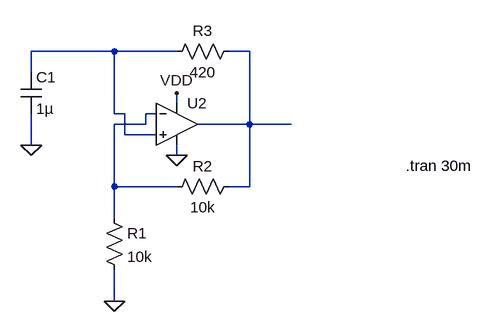
[diagram p0: schematic Draft1.asc]
Draft1.asc, the LTspice schematic file:
Version 4
SHEET 1 880 680
WIRE -272 -192 -400 -192
WIRE -176 -192 -272 -192
WIRE -64 -192 -96 -192
WIRE -400 -160 -400 -192
WIRE -176 -112 -176 -128
WIRE -272 -96 -272 -192
WIRE -256 -96 -272 -96
WIRE -208 -96 -224 -96
WIRE -224 -80 -224 -96
WIRE -224 -80 -272 -80
WIRE -64 -80 -64 -192
WIRE -64 -80 -144 -80
WIRE 0 -80 -64 -80
WIRE -256 -64 -256 -96
WIRE -208 -64 -256 -64
WIRE -400 -48 -400 -96
WIRE -176 -32 -176 -48
WIRE -272 16 -272 -80
WIRE -176 16 -272 16
WIRE -64 16 -64 -80
WIRE -64 16 -96 16
WIRE -272 64 -272 16
WIRE -272 192 -272 144
FLAG -400 -48 0
FLAG -272 192 0
FLAG -176 -32 0
FLAG -176 -128 VDD
SYMBOL res -288 48 R0
SYMATTR InstName R1
SYMATTR Value 10k
SYMBOL res -80 0 R90
WINDOW 0 0 56 VBottom 2
WINDOW 3 32 56 VTop 2
SYMATTR InstName R2
SYMATTR Value 10k
SYMBOL res -80 -208 R90
WINDOW 0 0 56 VBottom 2
WINDOW 3 32 56 VTop 2
SYMATTR InstName R3
SYMATTR Value 420
SYMBOL cap -416 -160 R0
SYMATTR InstName C1
SYMATTR Value 1µ
SYMBOL Opamps\\UniversalOpamp2 -176 -80 R0
SYMATTR InstName U2
TEXT 176 -16 Left 2 !.tran 30m

The netlist it stands for:
* Draft1.asc
R1 N003 0 10k
R2 N002 N003 10k
R3 N002 N001 420
C1 N001 0 1µ
XU2 N001 N003 VDD 0 N002 level.2 Avol=1Meg GBW=10Meg Slew=10Meg ilimit=25m rail=0 Vos=0 phimargin=45 en=0 enk=0 in=0 ink=0 Rin=500Meg  ; pins IN+ IN- V+ V- OUT
.tran 30m
.lib UniversalOpamps2.sub
.backanno
.end